# Altium schematic sheet [04] - POWER SUPPLY SCHEMATIC.SchDoc
size A4; DocumentNumber: 3; SheetNumber: 3; SheetTotal: 6
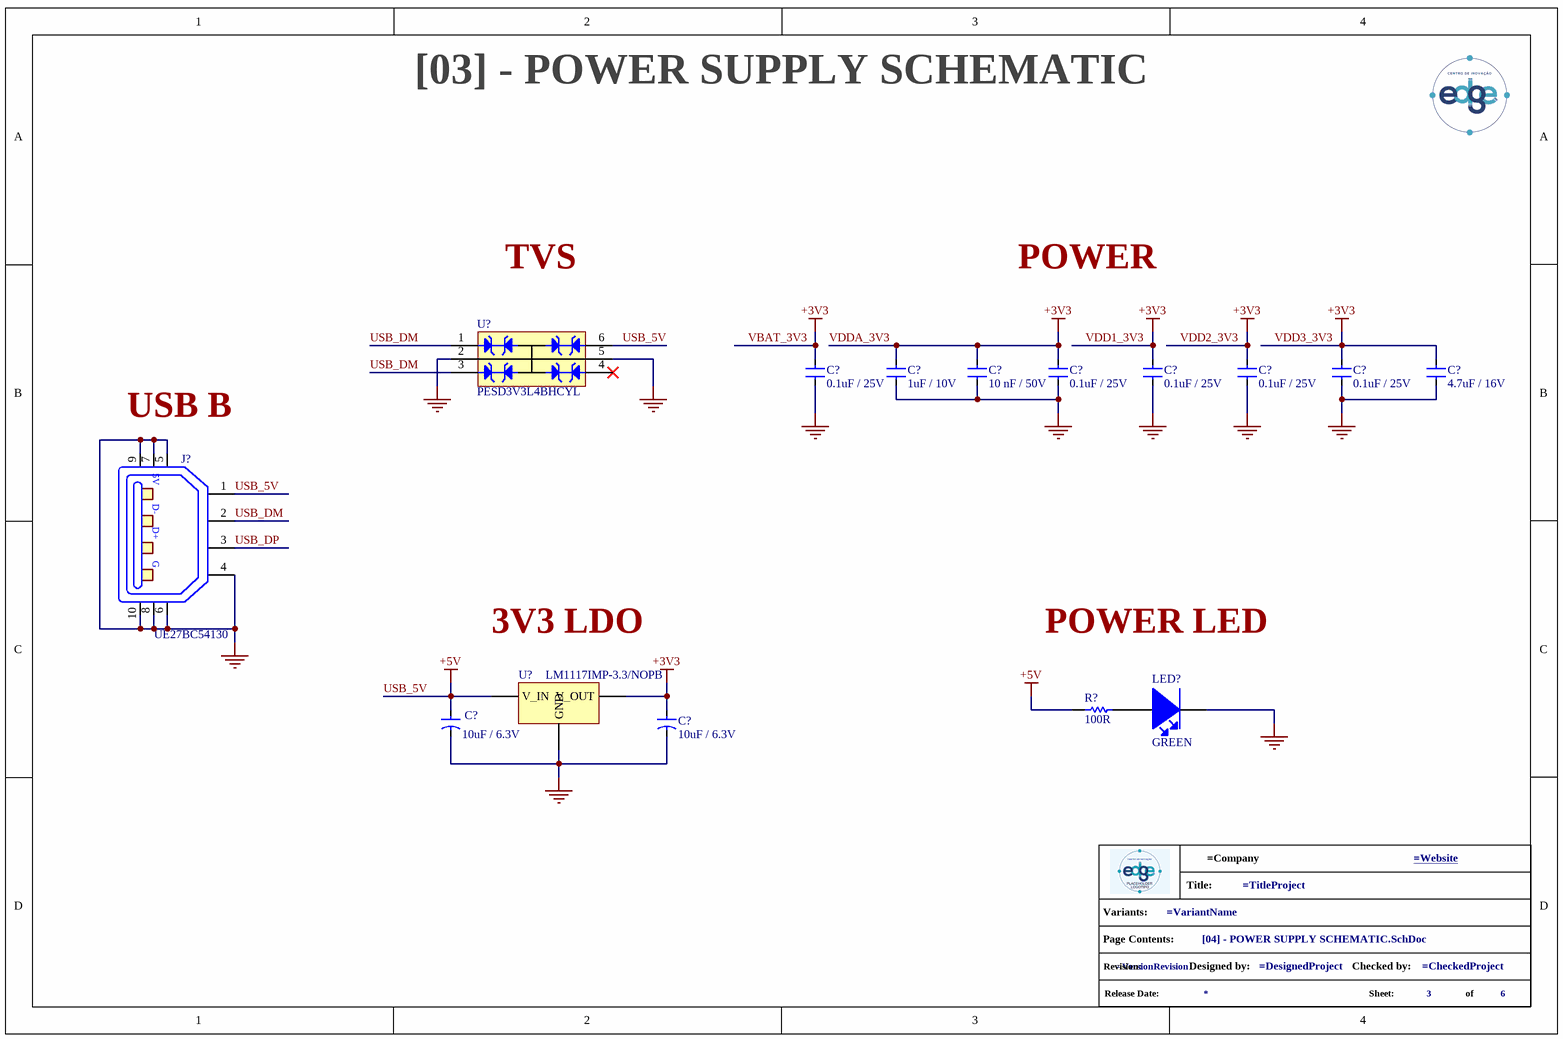
[diagram p0: [04] - POWER SUPPLY SCHEMATIC.SchDoc]

## Parts
(Parts that share a designator on the sheet are numbered #1, #2 ... from top to bottom, then left to right.)
*?  info_project  (value not drawn)  (graphical)
C?#1  0.1uF / 25V  [C0805]
C?#2  1uF / 10V  [C0805]
C?#3  10 nF / 50V  [C0805]
C?#4  0.1uF / 25V  [C0805]
C?#5  0.1uF / 25V  [C0805]
C?#6  0.1uF / 25V  [C0805]
C?#7  0.1uF / 25V  [C0805]
C?#8  4.7uF / 16V
C?#9  10uF / 6.3V  [CT0805]
C?#10  10uF / 6.3V  [CT0805]
J?  UE27BC54130  [UE27BC54130]
LED?  GREEN  [LED_0805]
R?  100R  [R0805]
U?#1  PESD3V3L4BHCYL  [PESD3V3L4BHCYL]
U?#2  LM1117IMP-3.3/NOPB  [LM1117]

## Nets
GND: C?#1.2 C?#2.2 C?#3.1 C?#4.2 C?#5.2 C?#6.2 C?#7.2 C?#8.1 C?#9.2 C?#10.2 J?.4 J?.5 J?.6 J?.7 J?.8 J?.9 J?.10 LED?.1(Cathode) U?#1.2 U?#1.5 U?#2.3(GND)
USB_5V: C?#9.1 J?.1 R?.2 U?#1.6 U?#2.1(V_IN)  [also labelled +5V]
VBAT_3V3: C?#1.1 C?#2.1 C?#3.2 C?#4.1 C?#5.1 C?#6.1 C?#7.1 C?#8.2 C?#10.1 U?#2.2(V_OUT)  [also labelled +3V3, VDD1_3V3, VDD2_3V3, VDD3_3V3, VDDA_3V3]
USB_DM: J?.2 U?#1.1 U?#1.3
USB_DP: J?.3
NetLED?_2: LED?.2(Anode) R?.1

Not connected (* = marked no-connect by the designer): U?#1 4*

## Notes on the sheet
- [03] - POWER SUPPLY SCHEMATIC
- TVS
- POWER
- (near J?) USB B
- 3V3 LDO
- POWER LED
- (in symbol info_project) Title:; Variants:; Page Contents:; Revision:; Designed by:; Checked by:; Release Date:; Sheet:; of
- (in symbol UE27BC54130) 5V; D-; D+; G

## Library data of the parts
C?#1 C?#4-C?#7 = CC0805KRX7R8BB104: MLCC - 0.1uF 25V 0805 X7R +/- 10%; Manufacturer: Yageo; Material: Ceramic; Capacitance: 100nF; Insulation Resistance: 100GR; Supplier 1: Digi-Key; Manufacturer Part Number: CC0805KRX7R8BB104; RoHS: Yes; Category: Ceramic Capacitors; Stock 1: 331734; Pricing 1: 1=0,12000, 10=0,08800, 50=0,04980, 100=0,04130, 500=0,02894, 1000=0,02396 (USD); Mount: Surface Mount; Case/Package: 0805; Number of Pins: 2; Case Code (Metric): 2012; Case Code (Imperial): 0805; Min Operating Temperature: -55°C; Max Operating Temperature: 125°C; Tolerance: 10%; Dielectric: X7R; Series: CC; Package Quantity: 1; Voltage Rating: 25V; Packaging: Tape and Reel; Voltage Rating (DC): 25V; Termination: SMD/SMT; Resistor Type: Ceramic; Length: 2mm; Width: 0.049inch; Height: 0.85mm; Depth: 1.25mm; Thickness: 0.033inch; Radiation Hardening: No; RoHS Compliant: Yes; REACH SVHC: No SVHC; Lead Free: Lead Free; Halogen Free: Halogen Free; ComponentLink1URL: https://datasheet.ciiva.com/145/mlccorderingcode-145007.pdf?src-supplier=Digi-Key; ComponentLink1Description: https://datasheet.ciiva.com/145/mlccorderingcode-145007.pdf?src-supplier=Digi-Key; ComponentLink2URL: https://datasheet.ciiva.com/145/mlccorderingcode-145008.pdf?src-supplier=Digi-Key; ComponentLink2Description: https://datasheet.ciiva.com/145/mlccorderingcode-145008.pdf?src-supplier=Digi-Key; ComponentLink3URL: https://datasheet.ciiva.com/145/mlccorderingcode-145009.pdf?src-supplier=Digi-Key; ComponentLink3Description: https://datasheet.ciiva.com/145/mlccorderingcode-145009.pdf?src-supplier=Digi-Key; ComponentLink4URL: https://datasheet.ciiva.com/8034/1784427-8034029.pdf?src-supplier=Element14; ComponentLink4Description: https://datasheet.ciiva.com/8034/1784427-8034029.pdf?src-supplier=Element14; ComponentLink5URL: https://datasheet.ciiva.com/8034/1784427-8034030.pdf?src-supplier=Element14; ComponentLink5Description: https://datasheet.ciiva.com/8034/1784427-8034030.pdf?src-supplier=Element14; ComponentLink6URL: https://datasheet.ciiva.com/8034/70765-8034031.pdf?src-supplier=Element14; ComponentLink6Description: https://datasheet.ciiva.com/8034/70765-8034031.pdf?src-supplier=Element14; ComponentLink7URL: https://datasheet.ciiva.com/46430/1850775-46430166.pdf?src-supplier=Element14; ComponentLink7Description: https://datasheet.ciiva.com/46430/1850775-46430166.pdf?src-supplier=Element14; ComponentLink8URL: https://datasheet.ciiva.com/28450/1489800-28450789.pdf?src-supplier=Element14; ComponentLink8Description: https://datasheet.ciiva.com/28450/1489800-28450789.pdf?src-supplier=Element14; ComponentLink9URL: https://datasheet.ciiva.com/15189/getdatasheetpartid-330244-15189223.pdf?src-supplier=Verical; ComponentLink9Description: https://datasheet.ciiva.com/15189/getdatasheetpartid-330244-15189223.pdf?src-supplier=Verical; ComponentLink10URL: https://datasheet.ciiva.com/16625/upy-gphc-x7r-6-3v-to-50v-8-16625546.pdf?src-supplier=Avnet+Europe; ComponentLink10Description: https://datasheet.ciiva.com/16625/upy-gphc-x7r-6-3v-to-50v-8-16625546.pdf?src-supplier=Avnet+Europe; Supplier Part Number 1: 311-1141-1-ND
C?#2 = LMF212B7105KGHT: MLCC - 1uF 10V 0805   X7R +/- 10%; Manufacturer: Taiyo Yuden; Supplier 1: Digi-Key; Manufacturer Part Number: LMF212B7105KGHT; RoHS: Yes; Stock 1: 5962; Pricing 1: 1=0.31000, 10=0.21100, 50=0.14040, 100=0.11930, 500=0.08422, 1000=0.07369 (USD); RoHS Compliant: Yes; Supplier Part Number 1: 587-6522-1-ND
C?#3 = C0805C103J5GEC7800: MLCC - 10nF 50V 0805 C0G +/- 5%; Manufacturer: KEMET; Supplier 1: Digi-Key; Manufacturer Part Number: C0805C103J5GEC7800; RoHS: No; Stock 1: 1119; Pricing 1: 1=0.31000, 10=0.21500, 50=0.14300, 100=0.12160, 500=0.08584, 1000=0.07511 (USD); Supplier Part Number 1: 399-C0805C103J5GEC7800CT-ND
C?#8 = GCM21BR71C475KA73L: MLCC - 4.7uF 16V 0805 X7R +/- 10%; Manufacturer: Murata; Supplier 1: Digi-Key; Manufacturer Part Number: GCM21BR71C475KA73L; RoHS: Yes; Category: Ceramic Capacitors; Stock 1: 262759; Pricing 1: 1=0,37000, 10=0,25300, 50=0,16900, 100=0,14360, 500=0,10138, 1000=0,08870 (USD); Mount: Surface Mount; Case/Package: 0805; Case Code (Metric): 2012; Case Code (Imperial): 0805; Weight: 0.000335oz; Min Operating Temperature: -55°C; Max Operating Temperature: 125°C; Tolerance: 10%; Capacitance: 4.7uF; Dielectric: X7R; Voltage Rating: 16V; Packaging: Tape and Reel; Package Quantity: 1; Voltage: 16V; Termination: SMD/SMT; Voltage Rating (DC): 16V; Series: GCM; Construction: Flat; Length: 2mm; Width: 0.049inch; Height: 1.25mm; Thickness: 0.055inch; Depth: 1.25mm; Ratings: AEC-Q200; Radiation Hardening: No; REACH SVHC: No SVHC; Lead Free: Lead Free; RoHS Compliant: Yes; ComponentLink1URL: https://datasheet.ciiva.com/11613/product-11613410.pdf?src-supplier=Avnet; ComponentLink1Description: https://datasheet.ciiva.com/11613/product-11613410.pdf?src-supplier=Avnet; ComponentLink2URL: https://datasheet.ciiva.com/11787/0900766b80ef92d0-11787002.pdf?src-supplier=RSComponents; ComponentLink2Description: https://datasheet.ciiva.com/11787/0900766b80ef92d0-11787002.pdf?src-supplier=RSComponents; ComponentLink3URL: https://datasheet.ciiva.com/140/s0717e-140483.pdf?src-supplier=Digi-Key; ComponentLink3Description: https://datasheet.ciiva.com/140/s0717e-140483.pdf?src-supplier=Digi-Key; ComponentLink4URL: https://datasheet.ciiva.com/140/s0717e-140484.pdf?src-supplier=Digi-Key; ComponentLink4Description: https://datasheet.ciiva.com/140/s0717e-140484.pdf?src-supplier=Digi-Key; Supplier Part Number 1: 490-5332-1-ND
C?#9 C?#10 = TAJR106M006RNJ: TAL CAP - 10uF 6.3V 0805 +/- 20%; Manufacturer: Kyocera AVX; Dielectric Material: Tantalum; ESR (Equivalent Series Resistance): 6R; Leakage Current: 600nA; Polarity: Polar; Dissipation Factor: 8%; Supplier 1: Digi-Key; Manufacturer Part Number: TAJR106M006RNJ; RoHS: Yes; Category: Tantalum Capacitors; Stock 1: 12500; Pricing 1: 1=0,44000, 10=0,30600, 50=0,21440, 100=0,18380, 500=0,13786, 1000=0,11641 (USD); Mount: Surface Mount,PCB; Case/Package: 0805; Number of Pins: 2; Case Code (Imperial): 0805; Case Code (Metric): 2012; Min Operating Temperature: -55°C; Max Operating Temperature: 125°C; Capacitance: 10uF; Tolerance: 20%; Voltage Rating: 6.3V; Package Quantity: 1; Packaging: Tape and Reel; Voltage Rating (DC): 6.3V; Termination: SMD/SMT; Voltage: 6.3V; Features: General Purpose; Length: 2.05mm; Width: 1.3mm; Height: 1.2mm; Depth: 1.3mm; Height - Seated (Max): 0.047inch; Lead Pitch: 0.85mm; Radiation Hardening: No; REACH SVHC: No SVHC; Lead Free: Lead Free; RoHS Compliant: Yes; ComponentLink1URL: https://datasheet.ciiva.com/264/tajlp-264013.pdf?src-supplier=Digi-Key; ComponentLink1Description: https://datasheet.ciiva.com/264/tajlp-264013.pdf?src-supplier=Digi-Key; ComponentLink2URL: https://datasheet.ciiva.com/264/tajlp-264014.pdf?src-supplier=Digi-Key; ComponentLink2Description: https://datasheet.ciiva.com/264/tajlp-264014.pdf?src-supplier=Digi-Key; ComponentLink3URL: https://datasheet.ciiva.com/264/tajlp-264015.pdf?src-supplier=Digi-Key; ComponentLink3Description: https://datasheet.ciiva.com/264/tajlp-264015.pdf?src-supplier=Digi-Key; ComponentLink4URL: https://datasheet.ciiva.com/3004/tajlp-3004573.pdf?src-supplier=Avnet; ComponentLink4Description: https://datasheet.ciiva.com/3004/tajlp-3004573.pdf?src-supplier=Avnet; ComponentLink5URL: https://datasheet.ciiva.com/11219/tajlp-11219710.pdf?src-supplier=Avnet; ComponentLink5Description: https://datasheet.ciiva.com/11219/tajlp-11219710.pdf?src-supplier=Avnet; ComponentLink6URL: https://datasheet.ciiva.com/14603/70001771-14603111.pdf?src-supplier=Allied+Electronics; ComponentLink6Description: https://datasheet.ciiva.com/14603/70001771-14603111.pdf?src-supplier=Allied+Electronics; ComponentLink7URL: https://datasheet.ciiva.com/14607/70001771-14607978.pdf?src-supplier=Allied+Electronics; ComponentLink7Description: https://datasheet.ciiva.com/14607/70001771-14607978.pdf?src-supplier=Allied+Electronics; ComponentLink8URL: https://datasheet.ciiva.com/7730/49917-7730781.pdf?src-supplier=Element14; ComponentLink8Description: https://datasheet.ciiva.com/7730/49917-7730781.pdf?src-supplier=Element14; ComponentLink9URL: https://datasheet.ciiva.com/7730/tajlp-7730988.pdf?src-supplier=Element14; ComponentLink9Description: https://datasheet.ciiva.com/7730/tajlp-7730988.pdf?src-supplier=Element14; Supplier Part Number 1: 478-3051-1-ND
J? = UE27BC54130: CONN USB RECPT B 2.0; Manufacturer: Amphenol Commercial; Number of Terminals/Pins: 4; Gender: Receptacle; Number of Ports: 1; Insulation Resistance: 1GR; Pitch: 2.5mm; Supplier 1: Digi-Key; Manufacturer Part Number: UE27BC54130; RoHS: Yes; Category: RF / Coaxial Connectors; Stock 1: 8145; Pricing 1: 1=1,15000, 10=1,01500, 25=0,95560, 40=0,91575, 120=0,87592, 240=0,79633, 480=0,71669, 960=0,63705, 2400=0,57733 (USD); Mount: Through Hole,Horizontal; Contact Plating: Gold; Color: Black; Contact Material: Bronze; Housing Material: Polybutylene; Termination: Solder; Packaging: Bulk; Connector Type: USB; Number of Contacts: 4; Orientation: Right Angle; Package Quantity: 3000; Series: UE27; Length: 12.04mm; Depth: 16.3mm; Radiation Hardening: No; ComponentLink1URL: https://datasheet.ciiva.com/851/ue27bcx4xxx-851809.pdf?src-supplier=Digi-Key; ComponentLink1Description: https://datasheet.ciiva.com/851/ue27bcx4xxx-851809.pdf?src-supplier=Digi-Key; ComponentLink2URL: https://datasheet.ciiva.com/10945/ue27bcx4xxx-10945210.pdf?src-supplier=Avnet; ComponentLink2Description: https://datasheet.ciiva.com/10945/ue27bcx4xxx-10945210.pdf?src-supplier=Avnet; ComponentLink3URL: https://datasheet.ciiva.com/16668/ue27bcx4xxx-16668218.pdf?src-supplier=Avnet+Europe; ComponentLink3Description: https://datasheet.ciiva.com/16668/ue27bcx4xxx-16668218.pdf?src-supplier=Avnet+Europe; Supplier Part Number 1: UE27BC54130-ND
LED? = 150080GS75000: SMD LED GREEN 3.2V 0805 20mA; Manufacturer: Wurth Electronics; Viewing Angle: 140°; Lens Style: Clear,Rectangular; Luminous Intensity: 450mcd; Wavelength: 520nm; Forward Current: 30mA; Supplier 1: Digi-Key; Manufacturer Part Number: 150080GS75000; RoHS: Yes; Category: LEDs; Stock 1: 102669; Pricing 1: 1=0,18000, 50=0,16500, 100=0,14200, 500=0,12300 (USD); Mount: Surface Mount; Case/Package: 0805; Color: Green; Case Code (Metric): 2012; Case Code (Imperial): 0805; Min Operating Temperature: -40°C; Max Operating Temperature: 85°C; Package Quantity: 4000; Forward Voltage: 3.2V; Packaging: Cut Tape; Dominant Wavelength: 520nm; Test Current: 20mA; Length: 2mm; Width: 1.25mm; Height: 0.7mm; REACH SVHC: Unknown; RoHS Compliant: Yes; ComponentLink1URL: https://datasheet.ciiva.com/29563/150080gs75000-29563008.pdf?src-supplier=Digi-Key; ComponentLink1Description: https://datasheet.ciiva.com/29563/150080gs75000-29563008.pdf?src-supplier=Digi-Key; ComponentLink2URL: https://datasheet.ciiva.com/29279/759434-da-01-en-chipled-0805-w-kl-gruen-150080gs75000-29279039.pdf?src-supplier=Conrad; ComponentLink2Description: https://datasheet.ciiva.com/29279/759434-da-01-en-chipled-0805-w-kl-gruen-150080gs75000-29279039.pdf?src-supplier=Conrad; Supplier Part Number 1: 732-4983-1-ND
R? = RC0805FR-07100RL: RES - 100R 1/8 0805 1%; Manufacturer: Yageo; Temperature Coefficient: 100ppm/°C; Voltage Rating (DC): 150V; Power Rating: 125mW; Application(s): HIGH RELIABILITY; Supplier 1: Digi-Key; Manufacturer Part Number: RC0805FR-07100RL; RoHS: Yes; Category: Chip SMD Resistors; Stock 1: 881028; Pricing 1: 1=0,10000, 10=0,04200, 100=0,01690, 1000=0,00759, 2500=0,00659 (USD); Case/Package: 0805; Number of Pins: 2; Case Code (Imperial): 0805; Case Code (Metric): 2012; Weight: 0.000917oz; Min Operating Temperature: -55°C; Max Operating Temperature: 155°C; Resistance: 100R; Tolerance: 1%; Resistor Type: Thick Film; Packaging: Cut Tape; Voltage Rating: 150V; Package Quantity: 5000; Termination: SMD/SMT; Number of Terminations: 2; Max Power Dissipation: 125mW; Features: Moisture Resistant; Type: General Purpose; Series: RC; Technology: THICK FILM; Length: 2mm; Width: 1.25mm; Height: 0.5mm; Depth: 1.25mm; Lead Pitch: 0.4mm; REACH SVHC: Unknown; Lead Free: Lead Free; Military Standard: Not; RoHS Compliant: Yes; ComponentLink1URL: https://datasheet.ciiva.com/11808/0900766b8106beab-11808877.pdf?src-supplier=RSComponents; ComponentLink1Description: https://datasheet.ciiva.com/11808/0900766b8106beab-11808877.pdf?src-supplier=RSComponents; ComponentLink2URL: https://datasheet.ciiva.com/7941/1697719-7941680.pdf?src-supplier=Element14; ComponentLink2Description: https://datasheet.ciiva.com/7941/1697719-7941680.pdf?src-supplier=Element14; ComponentLink3URL: https://datasheet.ciiva.com/7941/1686128-7941679.pdf?src-supplier=Element14; ComponentLink3Description: https://datasheet.ciiva.com/7941/1686128-7941679.pdf?src-supplier=Element14; ComponentLink4URL: https://datasheet.ciiva.com/7660/38627-7660797.pdf?src-supplier=Element14; ComponentLink4Description: https://datasheet.ciiva.com/7660/38627-7660797.pdf?src-supplier=Element14; ComponentLink5URL: https://datasheet.ciiva.com/22747/444164-22747535.pdf?src-supplier=Element14; ComponentLink5Description: https://datasheet.ciiva.com/22747/444164-22747535.pdf?src-supplier=Element14; ComponentLink6URL: https://datasheet.ciiva.com/46447/444164-46447562.pdf?src-supplier=Element14; ComponentLink6Description: https://datasheet.ciiva.com/46447/444164-46447562.pdf?src-supplier=Element14; ComponentLink7URL: https://datasheet.ciiva.com/2456/pyu-r-int-thick-7-2456988.pdf?src-supplier=Digi-Key; ComponentLink7Description: https://datasheet.ciiva.com/2456/pyu-r-int-thick-7-2456988.pdf?src-supplier=Digi-Key; ComponentLink8URL: https://datasheet.ciiva.com/2456/pyu-r-int-thick-7-2456989.pdf?src-supplier=Digi-Key; ComponentLink8Description: https://datasheet.ciiva.com/2456/pyu-r-int-thick-7-2456989.pdf?src-supplier=Digi-Key; ComponentLink9URL: https://datasheet.ciiva.com/2456/pyu-r-int-thick-7-2456987.pdf?src-supplier=Digi-Key; ComponentLink9Description: https://datasheet.ciiva.com/2456/pyu-r-int-thick-7-2456987.pdf?src-supplier=Digi-Key; ComponentLink10URL: https://datasheet.ciiva.com/17082/rc0805-17082697.pdf?src-supplier=Future+Electronics; ComponentLink10Description: https://datasheet.ciiva.com/17082/rc0805-17082697.pdf?src-supplier=Future+Electronics; Supplier Part Number 1: 311-100CRCT-ND
U?#1 = PESD3V3L4BHCYL: ESD TVS DIODE VRWM - 3V3 / VBR - 6.7-8.5V /; Manufacturer: Nexperia; Supplier 1: Digi-Key; Manufacturer Part Number: PESD3V3L4BHCYL; RoHS: No; Category: TVS Diodes; Stock 1: 14700; Pricing 1: 1=0,39000, 10=0,31400, 25=0,28720, 100=0,21370, 250=0,19368, 500=0,16028, 1000=0,12020, 2500=0,11019, 5000=0,10395 (USD); Supplier Part Number 1: 1727-8586-1-ND
U?#2 = LM1117IMP-3.3/NOPB: IC REG LDO 3.3V 800mA SOT223; Manufacturer: Texas Instruments; Number of Outputs: 1; Max Input Voltage: 15V; Polarity: Positive; Quiescent Current: 15mA; Accuracy: 1%; Output Type: Fixed; Dropout Voltage: 1.2V; Min Input Voltage: 2.6V; Max Supply Voltage: 10V; Min Supply Voltage: 4.75V; Current Rating: 800A; Supplier 1: Mouser; Manufacturer Part Number: LM1117IMP-3.3/NOPB; RoHS: Yes; Category: Voltage Regulators - Linear; Stock 1: 5; Pricing 1: 1=1,28000, 10=1,15000, 50=1,09000, 100=0,89500, 1000=0,58300, 10000=0,58300 (USD); Mount: Surface Mount; Case/Package: SOT-223; Number of Pins: 4; Min Operating Temperature: -40°C; Max Operating Temperature: 125°C; Output Voltage: 3.3V; Max Output Current: 800mA; Packaging: Tape and Reel; Output Current: 800mA; Nominal Output Voltage: 3.3V; Termination: SMD/SMT; Output Voltage Accuracy: 1%; Number of Regulators: 1; Min Current Limit: 800mA; Package Quantity: 1000; Length: 6.5mm; Width: 3.56mm; Height: 1.6mm; Radiation Hardening: No; REACH SVHC: No SVHC; Lead Free: Lead Free; RoHS Compliant: Yes; ComponentLink1URL: https://datasheet.ciiva.com/27051/1281318-27051810.pdf?src-supplier=Jameco; ComponentLink1Description: https://datasheet.ciiva.com/27051/1281318-27051810.pdf?src-supplier=Jameco; ComponentLink2URL: https://datasheet.ciiva.com/8042/1670636-8042261.pdf?src-supplier=Element14; ComponentLink2Description: https://datasheet.ciiva.com/8042/1670636-8042261.pdf?src-supplier=Element14; ComponentLink3URL: https://datasheet.ciiva.com/1570/1849796-1570171.pdf?src-supplier=Farnell; ComponentLink3Description: https://datasheet.ciiva.com/1570/1849796-1570171.pdf?src-supplier=Farnell; ComponentLink4URL: https://datasheet.ciiva.com/14149/lm1117-eng-tds-14149980.pdf?src-supplier=Distrelec; ComponentLink4Description: https://datasheet.ciiva.com/14149/lm1117-eng-tds-14149980.pdf?src-supplier=Distrelec; ComponentLink5URL: https://datasheet.ciiva.com/46386/1882372-46386042.pdf?src-supplier=Element14; ComponentLink5Description: https://datasheet.ciiva.com/46386/1882372-46386042.pdf?src-supplier=Element14; ComponentLink6URL: https://datasheet.ciiva.com/3223/lm1117-n-3223515.pdf?src-supplier=Avnet; ComponentLink6Description: https://datasheet.ciiva.com/3223/lm1117-n-3223515.pdf?src-supplier=Avnet; ComponentLink7URL: https://datasheet.ciiva.com/6580/lm1117-n-6580030.pdf?src-supplier=Digi-Key; ComponentLink7Description: https://datasheet.ciiva.com/6580/lm1117-n-6580030.pdf?src-supplier=Digi-Key; ComponentLink8URL: https://datasheet.ciiva.com/6580/lm1117-n-6580026.pdf?src-supplier=Digi-Key; ComponentLink8Description: https://datasheet.ciiva.com/6580/lm1117-n-6580026.pdf?src-supplier=Digi-Key; Supplier Part Number 1: 926-LM1117IMP3.3NOPB